# EAGLE schematic ACS722_Low_Current_Sensor (EAGLE 7.2.0)
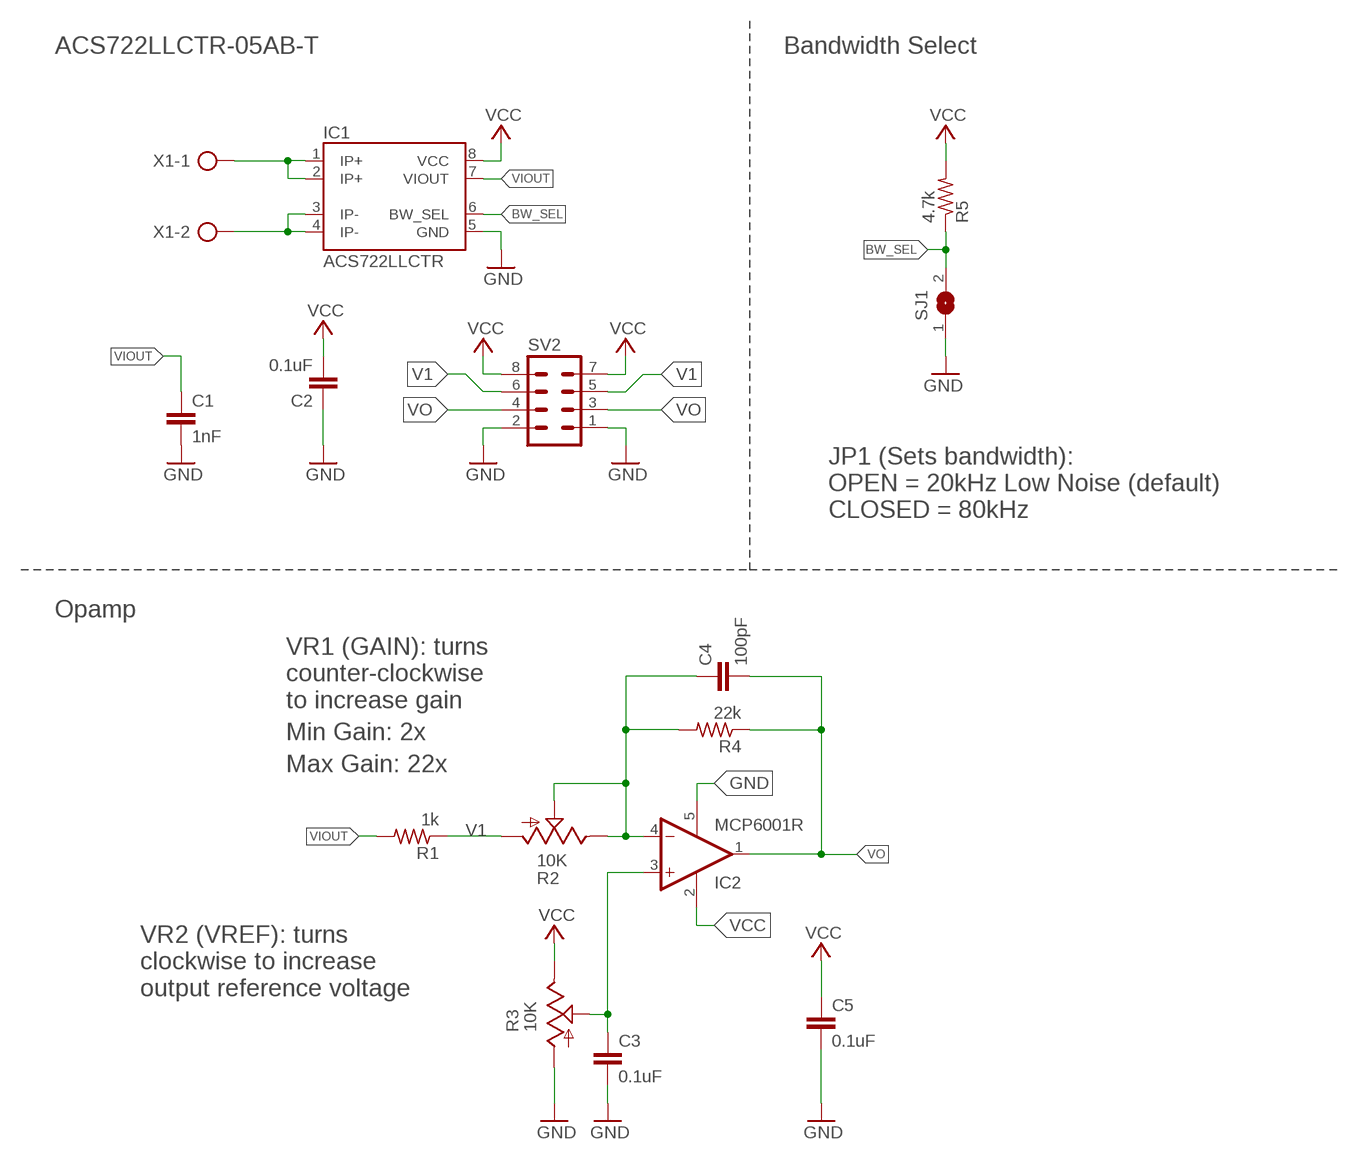
[diagram p0: schematic, sheet 1]

## Parts
C1  1nF  C-EUC1206  [C1206]
C2  0.1uF  C-EUC1206  [C1206]
C3  0.1uF  C-EUC1206  [C1206]
C4  100pF  C-EUC1206  [C1206]
C5  0.1uF  C-EUC1206  [C1206]
IC1  ACS722LLCTR  ACS722LLCTR-05AB-T  [SO-08]
IC2  MCP6001R  [SOT23-5]
R1  1k  R-US_R1206  [R1206]
R2  10K  TRIM_US-CA9V  [CA9V]
R3  10K  TRIM_US-CA9V  [CA9V]
R4  22k  R-US_R1206  [R1206]
R5  4.7k  R-US_R1206  [R1206]
SJ1  SJ  [SJ]
SV2  MA04-2  [MA04-2]
X1  AK500/2  [AK500/2]

## Nets
BW_SEL: IC1.6(BW_SEL) R5.1 SJ1.2
GND: C1.2 C2.1 C3.2 C5.2 IC1.5(GND) IC2.5(V-) R3.A SJ1.1 SV2.1 SV2.2
IP+: IC1.1(IP+) IC1.2(IP+) X1.1
IP-: IC1.3(IP-) IC1.4(IP-) X1.2
N$5: C4.1 IC2.4(-IN) R2.E R2.S R4.2
N$6: C3.1 IC2.3(+IN) R3.S
V1: R1.1 R2.A SV2.5 SV2.6
VCC: C2.2 C5.1 IC1.8(VCC) IC2.2(V+) R3.E R5.2 SV2.7 SV2.8
VIOUT: C1.1 IC1.7(VIOUT) R1.2
VO: C4.2 IC2.1(OUT) R4.1 SV2.3 SV2.4

## Notes on the sheet
- ACS722LLCTR-05AB-T | Bandwidth Select
- JP1 (Sets bandwidth):
- OPEN = 20kHz Low Noise (default)
- CLOSED = 80kHz
- Opamp
- VR1 (GAIN): turns
  counter-clockwise 
  to increase gain
- Min Gain: 2x
- Max Gain: 22x
- VR2 (VREF): turns
  clockwise to increase 
  output reference voltage

## Library data of the parts
C1-C5 = rcl:C-EU: CAPACITOR, European symbol
IC1 = ALFATEK_Sensores:ACS722: ACS722LLCTR-05AB-T SENSOR CURRENT HALL 5A AC/DC
IC2 = ALFATEK_CircuitosIntegrados:MCP6001: Single Op Amp 1.8V to 6.0V Single Supply CMOS Source: https://www.mouser.mx/datasheet/2/268/21733j-740845.pdf
R1 R4 R5 = rcl:R-US_: RESISTOR, American symbol
R2 R3 = pot:TRIM_US-: POTENTIOMETER
SJ1 = ALFATEK_Conectores:SJ: SMD solder JUMPER
SV2 = EYR_Conectores:MA04-2: PIN HEADER; OC_FARNELL: unknown; OC_NEWARK: unknown
X1 = con-ptr500:AK500/2: CONNECTOR; OC_FARNELL: unknown; OC_NEWARK: unknown

## Net classes
1 8_mil: width 0.203 mm
2 10_mil: width 0.254 mm
3 12_mil: width 0.305 mm
4 15_mil: width 0.381 mm
5 20_mil: width 0.508 mm
6 25_mil: width 0.635 mm
7 30_mil: width 0.762 mm